# EAGLE design Qwiic_ADC_ADS1015 (EAGLE 6.5.0)
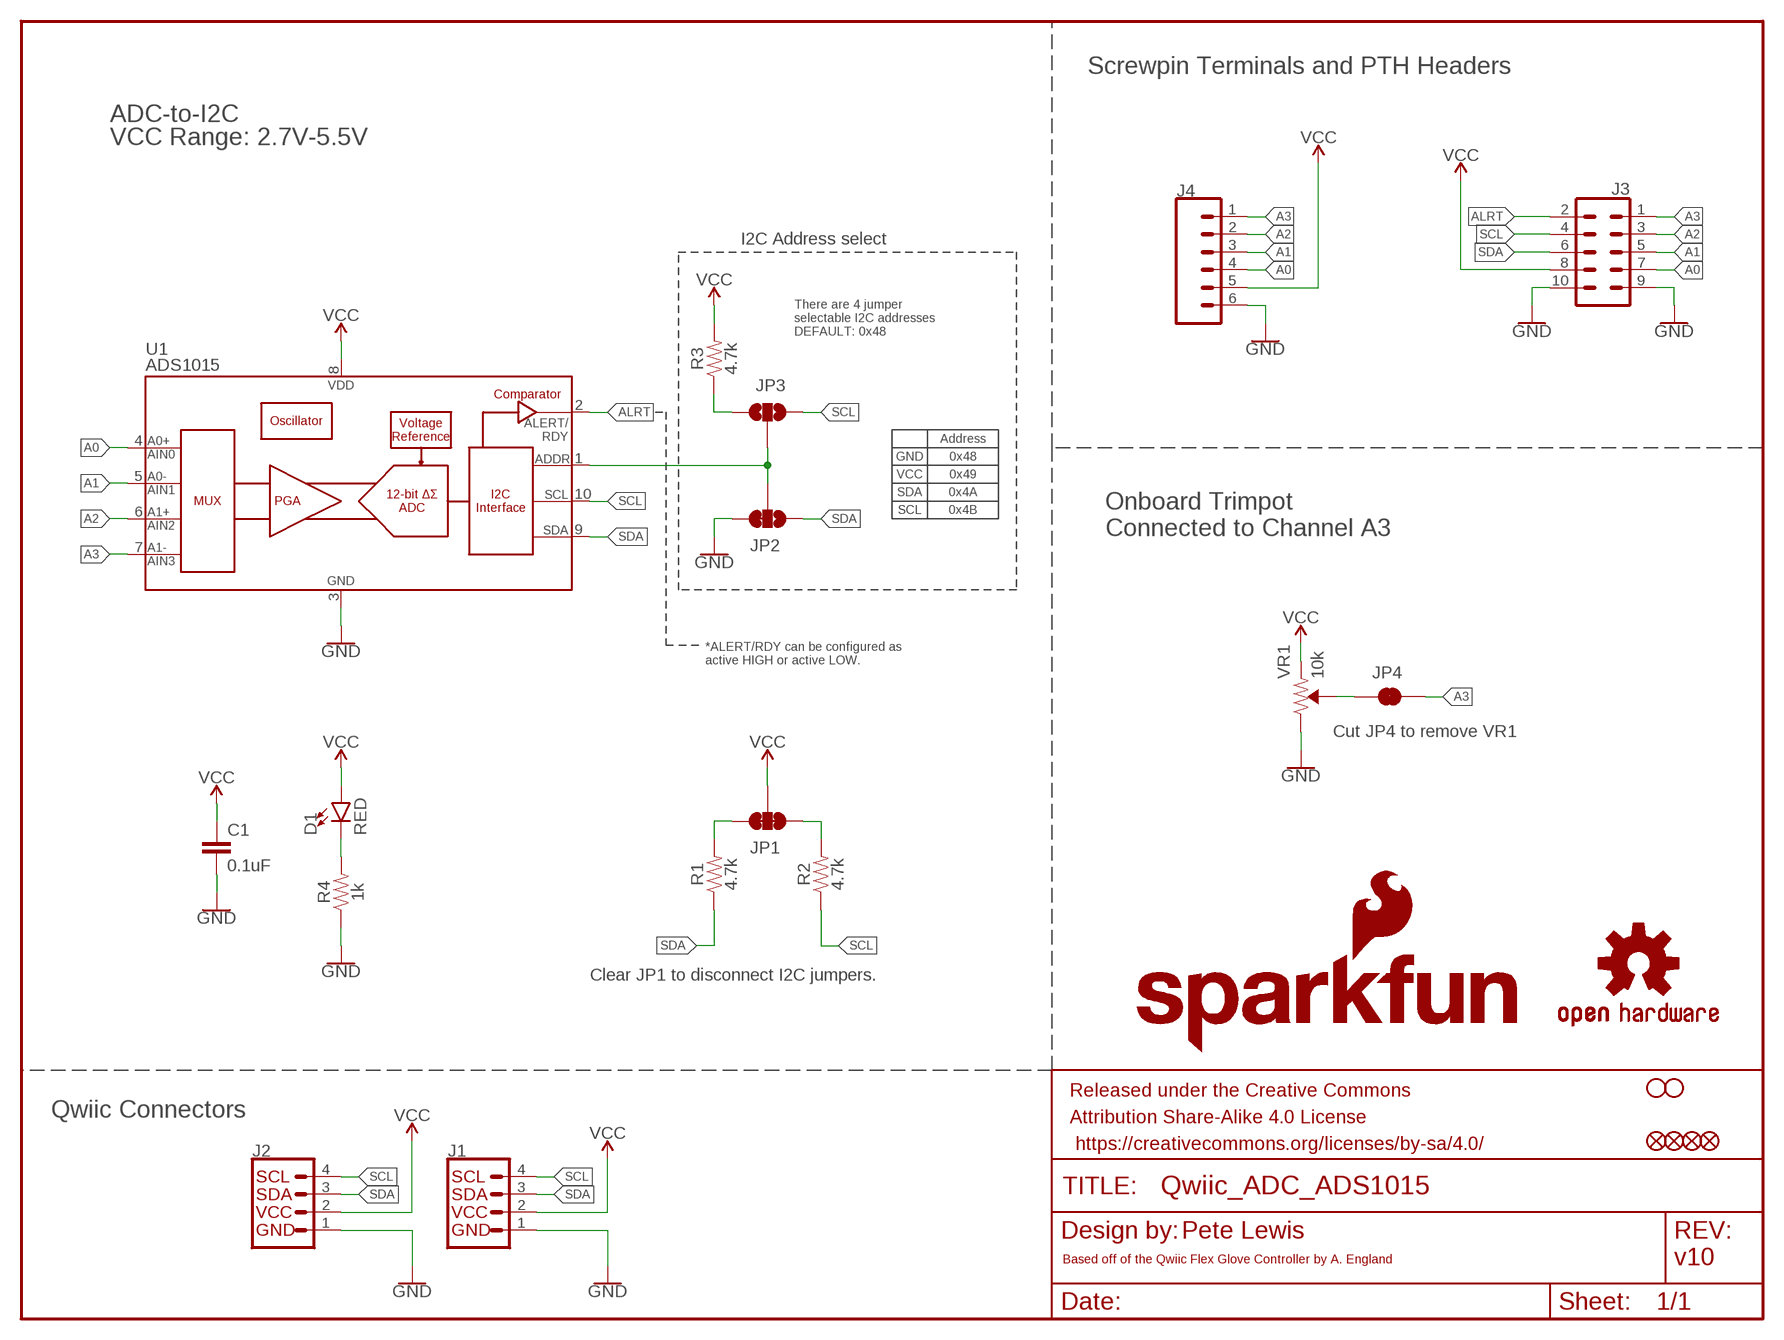
[diagram p0: schematic, sheet 1]

## Parts
C1  0.1uF  0.1UF-0603-25V-(+80/-20%)  [0603]
D1  RED  LED-RED0603  [LED-0603]
FD1  FIDUCIALUFIDUCIAL  [FIDUCIAL-MICRO]
FD2  FIDUCIALUFIDUCIAL  [FIDUCIAL-MICRO]
FD3  FIDUCIALUFIDUCIAL  [FIDUCIAL-MICRO]
FD4  FIDUCIALUFIDUCIAL  [FIDUCIAL-MICRO]
FRAME1  FRAME-LETTER  [CREATIVE_COMMONS]
H1  STAND-OFF  [STAND-OFF]
H2  STAND-OFF  [STAND-OFF]
J1  QWIIC_CONNECTORJS-1MM  [JST04_1MM_RA]
J2  QWIIC_CONNECTORJS-1MM  [JST04_1MM_RA]
J3  CONN_05X2NO_SILK  [2X5_NOSILK]
J4  Screw Pin  CONN_063.5MM-6  [SCREWTERMINAL-3.5MM-6]
JP1  JUMPER-SMT_3_2-NC_TRACE_NO-SILK  [SMT-JUMPER_3_2-NC_TRACE_NO-SILK]
JP2  JUMPER-SMT_3_1-NC_TRACE_NO-SILK  [SMT-JUMPER_3_1-NC_TRACE_NO-SILK]
JP3  JUMPER-SMT_3_NO_NO_SILK  [SMT-JUMPER_3_0-NO_TRACE_NO-SILK]
JP4  JUMPER-SMT_2_NC_TRACE_SILK  [SMT-JUMPER_2_NC_TRACE_SILK]
LOGO1  SFE_LOGO_NAME.1_INCH  [SFE_LOGO_NAME_.1]
LOGO2  OSHW-LOGOS  [OSHW-LOGO-S]
LOGO3  SFE_LOGO_FLAME.1_INCH  [SFE_LOGO_FLAME_.1]
R1  4.7k  4.7KOHM-0603-1/10W-1%  [0603]
R2  4.7k  4.7KOHM-0603-1/10W-1%  [0603]
R3  4.7k  4.7KOHM-0603-1/10W-1%  [0603]
R4  1k  1KOHM-0603-1/10W-1%  [0603]
U1  ADS1015  [MSOP10]
VR1  10k  TRIMPOT-SMD-3MM-CLOSED-1/8W-20%  [TRIMPOT-SMD-3MM-CLOSED]

## Nets
A0: J3.7 J4.4 U1.4(AIN0)
A1: J3.5 J4.3 U1.5(AIN1)
A2: J3.3 J4.2 U1.6(AIN2)
A3: J3.1 J4.1 JP4.2 U1.7(AIN3)
ADDR: JP2.2 JP3.2 U1.1(ADDR)
ALRT: J3.2 U1.2(ALERT/RDY)
GND: C1.2 J1.1 J2.1 J3.9 J3.10 J4.6 JP2.3 R4.1 U1.3(VSS) VR1.3(CW)
N$1: JP4.1 VR1.2(WIPER)
N$2: D1.C R4.2
N$3: JP3.1 R3.1
N$7: JP1.1 R2.2
N$8: JP1.3 R1.2
SCL: J1.4 J2.4 J3.4 JP3.3 R2.1 U1.10(SCL)
SDA: J1.3 J2.3 J3.6 JP2.1 R1.1 U1.9(SDA)
VCC: C1.1 D1.A J1.2 J2.2 J3.8 J4.5 JP1.2 R3.2 U1.8(VDD) VR1.1(CCW)

## Notes on the sheet
- Screwpin Terminals and PTH Headers
- ADC-to-I2C
- VCC Range: 2.7V-5.5V
- I2C Address select
- There are 4 jumper 
  selectable I2C addresses
  DEFAULT: 0x48
- Address
- GND | 0x48
- VCC | 0x49
- SDA | 0x4A
- SCL | 0x4B
- Onboard Trimpot
  Connected to Channel A3
- *ALERT/RDY can be configured as
  active HIGH or active LOW.
- Cut JP4 to remove VR1
- Clear JP1 to disconnect I2C jumpers.
- Qwiic Connectors
- Pete Lewis
- Based off of the Qwiic Flex Glove Controller by A. England | v10

## Library data of the parts
C1 = SparkFun-Capacitors:0.1UF: 0.1µF ceramic capacitors A capacitor is a passive two-terminal electrical component used to store electrical energy temporarily in an electric field.; PROD_ID: CAP-00810
D1 = SparkFun-LED:LED-RED: Red SMD LED Used in manufacturing of most products at SparkFun Packages: 0603 - SMD 0603 package [Product Link] <http://docs.avagotech.com/docs/AV02-0551EN> 0603 SMART - SMD 0603 SMART package ( more efficient and expensive)[Product Link] <http://www.osram-os.com/Graphics/XPic2/00077099_0.pdf> 1206 - SMD1206 package [Product Link] <https://www.sparkfun.com/datasheets/DevTools/LilyPad/Q150OVS4.pdff> SparkFun Products: Pro Mini 328 -5V <https://www.sparkfun.com/products/821> RedBoard <https://www.sparkfun.com/products/12757> IOIO-OTG <https://www.sparkfun.com/products/13613>; PROD_ID: DIO-00819
FD1-FD4 = SparkFun-Aesthetics:FIDUCIAL: Fiducial Alignment Points Point-of-reference for pick-and-place machines and other optical instruments.
FRAME1 = SparkFun-Aesthetics:FRAME-LETTER: Schematic Frame - Letter Standard 8.5x11 US Letter frame
H1 H2 = SparkFun-Hardware:STAND-OFF: Stand Off Drill holes for mechanically mounting via screws, standoffs, etc. Note: Use the keepout ring to avoid running the screw head into surrounding components. Variant Overviews STAND-OFF - Mechanical footprint for a #4 phillips button head screw. STAND-OFF-TIGHT - Mechanical footprint for a #4 phillips button head screw, Example SparkFun Products Screw - Phillips Head (1/4", 4-40, 10 pack) <https://www.sparkfun.com/products/10453> (PRT-10453) Screw - Phillips Head (1/2", 4-40, 10 pack) <https://www.sparkfun.com/products/10452> (PRT-10452) Screw - Phillips Head (3/4", 4-40, 10 pack) <https://www.sparkfun.com/products/10451> (PRT-10451) Screw - Phillips Head (1", 4-40, 10 pack) <https://www.sparkfun.com/products/10450> (PRT-10450)
J1 J2 = SparkFun-Connectors:QWIIC_CONNECTOR: SparkFun I2C Standard Qwiic Connector An SMD 1mm pitch JST connector makes it easy and quick (get it? Qwiic?) to connect I2C devices to each other. The Qwiic system <http://www.sparkfun.com/qwiic> enables fast and solderless connection between popular platforms and various sensors and actuators. We carry 200mm <https://www.sparkfun.com/products/14204>, 100mm <https://www.sparkfun.com/products/14205>, 50mm <https://www.sparkfun.com/products/14206>, and breadboard friendly <https://www.sparkfun.com/products/14207> Qwiic cables. We also offer 10 pcs strips <https://www.sparkfun.com/products/14323> the SMD connectors.; PROD_ID: CONN-13694
J3 = SparkFun-Connectors:CONN_05X2: Multi connection point. Often used as Generic Header-pin footprint for 0.1 inch spaced/style header connections For AVR SPI programming port, see special device with nice symbol: "AVR_SPI_PROG_5x2.dev" You can populate with any combo of single row headers, but if you'd like an exact match, check these: 2x5 AVR ICSP Male Header <https://www.sparkfun.com/products/778> (PRT-00778) 2x5 Pin Shrouded Header <https://www.sparkfun.com/products/8506> (PRT-08506) On any of the 0.1 inch spaced packages, you can populate with these: Break Away Headers - Straight <https://www.sparkfun.com/products/116> (PRT-00116) Break Away Male Headers - Right Angle <https://www.sparkfun.com/products/553> (PRT-00553) Female Headers <https://www.sparkfun.com/products/115> (PRT-00115) Break Away Headers - Machine Pin <https://www.sparkfun.com/products/117> (PRT-00117) Break Away Female Headers - Swiss Machine Pin <https://www.sparkfun.com/products/743> (PRT-00743) Special note: the shrouded connector mates well with our 5x2 ribbon cables: 2x5 Pin IDC Ribbon Cable <https://www.sparkfun.com/products/8535> (PRT-08535)
J4 = SparkFun-Connectors:CONN_06: Multi connection point. Often used as Generic Header-pin footprint for 0.1 inch spaced/style header connections On any of the 0.1 inch spaced packages, you can populate with these: Break Away Headers - Straight <https://www.sparkfun.com/products/116> (PRT-00116) Break Away Male Headers - Right Angle <https://www.sparkfun.com/products/553> (PRT-00553) Female Headers <https://www.sparkfun.com/products/115> (PRT-00115) Break Away Headers - Machine Pin <https://www.sparkfun.com/products/117> (PRT-00117) Break Away Female Headers - Swiss Machine Pin <https://www.sparkfun.com/products/743> (PRT-00743) Arduino Stackable Header - 6 Pin <https://www.sparkfun.com/products/9280> (PRT-09280) For SCREWTERMINALS and SPRING TERMINALS visit here: Screw Terimnals on SparkFun.com <https://www.sparkfun.com/search/results?term=Screw+Terminals> (5mm/3.5mm/2.54mm spacing) This device is also useful as a general connection point to wire up your design to another part of your project. Our various solder wires solder well into these plated through hole pads. Hook-Up Wire - Assortment (Stranded, 22 AWG) <https://www.sparkfun.com/products/11375> (PRT-11375) Hook-Up Wire - Assortment (Solid Core, 22 AWG) <https://www.sparkfun.com/products/11367> (PRT-11367) View the entire wire category on our website here <https://www.sparkfun.com/categories/141>; PROD_ID: CONN-13617
JP1 = SparkFun-Jumpers:JUMPER-SMT_3_2-NC_TRACE: Normally closed trace jumper (2 of 2 connections) This jumper has a trace between all three pads so they are normally closed (NC). Use a razor knife to open the connection(s). For best results follow the IPC guidelines for cutting traces: Cutout at least 0.063 mm (0.005 in). Remove all loose material to clean up the cut area. Seal the cut with an approved epoxy. Reapply solder to reclose the connection(s).
JP2 = SparkFun-Jumpers:JUMPER-SMT_3_1-NC_TRACE: Normally closed trace jumper (1 of 2 connections) This jumper has a trace between two pads so it's normally closed (NC). The other connection is normally open (NO). Use a razor knife to open the connection. For best results follow the IPC guidelines for cutting traces: Cutout at least 0.063 mm (0.005 in). Remove all loose material to clean up the cut area. Seal the cut with an approved epoxy. Reapply solder to reclose the connection, or to close the NO connection.
JP3 = SparkFun-Jumpers:JUMPER-SMT_3_NO: Normally open jumper This jumper has three pads in close proximity to each other. Apply solder to close the connection(s).
JP4 = SparkFun-Jumpers:JUMPER-SMT_2_NC_TRACE: Normally closed trace jumper This jumper has a trace between two pads so it's normally closed (NC). Use a razor knife to open the connection. For best results follow the IPC guidelines for cutting traces: Cutout at least 0.063 mm (0.005 in). Remove all loose material to clean up the cut area. Seal the cut with an approved epoxy. Reapply solder to reclose the connection.
LOGO1 = SparkFun-Aesthetics:SFE_LOGO_NAME: SparkFun Font Logo This is the SparkFun name logo. The logo on the schematic will always be the same size; the package variant is the height of the flame part of the logo (or the height the flame would be, if it were drawn). Default layer for the logo on the board is tSilk.
LOGO2 = SparkFun-Aesthetics:OSHW-LOGO: Open-Source Hardware (OSHW) Logo This logo indicates the piece of hardware it is found on incorporates a OSHW license and/or adheres to the definition of open source hardware found here: http://freedomdefined.org/OSHW
LOGO3 = SparkFun-Aesthetics:SFE_LOGO_FLAME: SparkFun Flame Logo This is the SparkFun flame logo. The logo on the schematic will always be the same size; the package variant is the height of the flame. Default layer for the logo on the board is tSilk.
R1-R3 = SparkFun-Resistors:4.7KOHM: 4.7kΩ resistor A resistor is a passive two-terminal electrical component that implements electrical resistance as a circuit element. Resistors act to reduce current flow, and, at the same time, act to lower voltage levels within circuits. - Wikipedia; PROD_ID: RES-07857
R4 = SparkFun-Resistors:1KOHM: 1kΩ resistor A resistor is a passive two-terminal electrical component that implements electrical resistance as a circuit element. Resistors act to reduce current flow, and, at the same time, act to lower voltage levels within circuits. - Wikipedia; PROD_ID: RES-07856
U1 = SparkFun-IC-Conversion:ADS1015: ADS1015 12-BIT ADC 12-Bit Del-Sig ADC Four single-ended inputs or two differential inputs Internal PGA I2C interface 2.0-5.5V SparkFun Products SparkFun Block for Intel Edison - ADC <https://www.sparkfun.com/products/13770> (DEV-13770); PROD_ID: IC-12270
VR1 = SparkFun-Resistors:TRIMPOT: Trimming Potentiometer (Trimpot) Three-terminal potentiometers, with an adjustable wiper and two adjustable resistors. A pot can be used to create a configurable voltage divider, or as a variable resistor. "Trimpots" are a subset of potentiometers, usually intended for "set-and-forget" applications. They're often more delicate than standard potentiometers - rated for fewer turns. Variants PTH-KNOB - PTH Trimpot w/ finger-adjustable knob Trimpot 10K with Knob <https://www.sparkfun.com/products/9806> (COM-09806) Datasheet <http://www.sparkfun.com/datasheets/Components/General/TSR-3386.pdf> SMD-3MM-CLOSED-FRAME - SMD 3mm Square Closed-Frame Trimpot Used on e.g. EasyDriver - Stepper Motor Driver <https://www.sparkfun.com/products/12779> Datasheet <http://www.bitechnologies.com/pdfs/22.pdf> (22AR10KTR) SMD-5MM - SMD 5mm Square Closed-Frame Trimpot Used on e.g. IOIO-OTG - V2.2 <https://www.sparkfun.com/products/13613> Datasheet <http://www.vishay.com/docs/51008/ts53.pdf> (TS53YL502MR10) SMD-3MM-1/10W-25% - 3mm Square Open-Frame Trimpot Used on e.g. SparkFun Shapeoko <https://www.sparkfun.com/products/13899> Datasheet <http://www.bourns.com/docs/Product-Datasheets/TC33.pdf> (TC33X-2-103E); PROD_ID: RES-09285

## Board
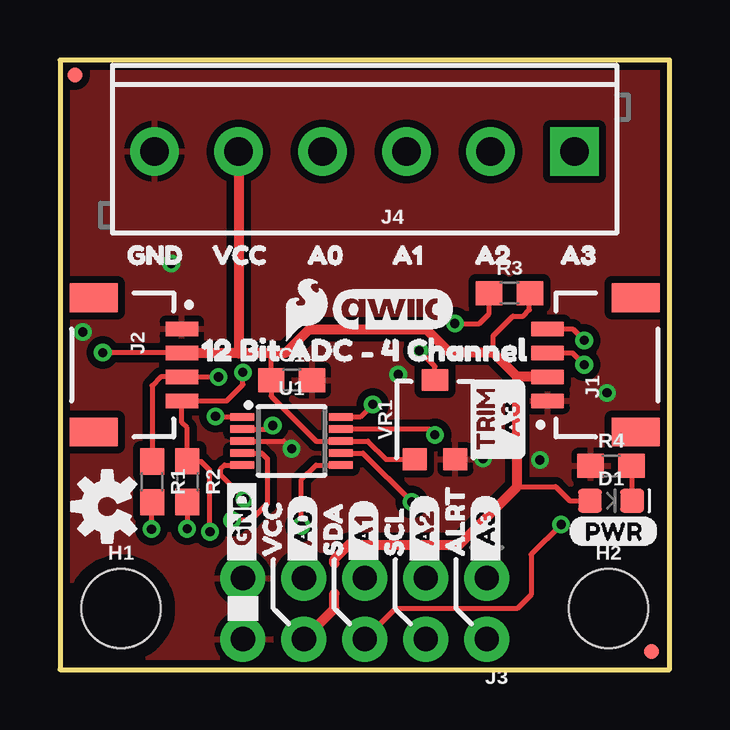
[diagram p1: board, top side]
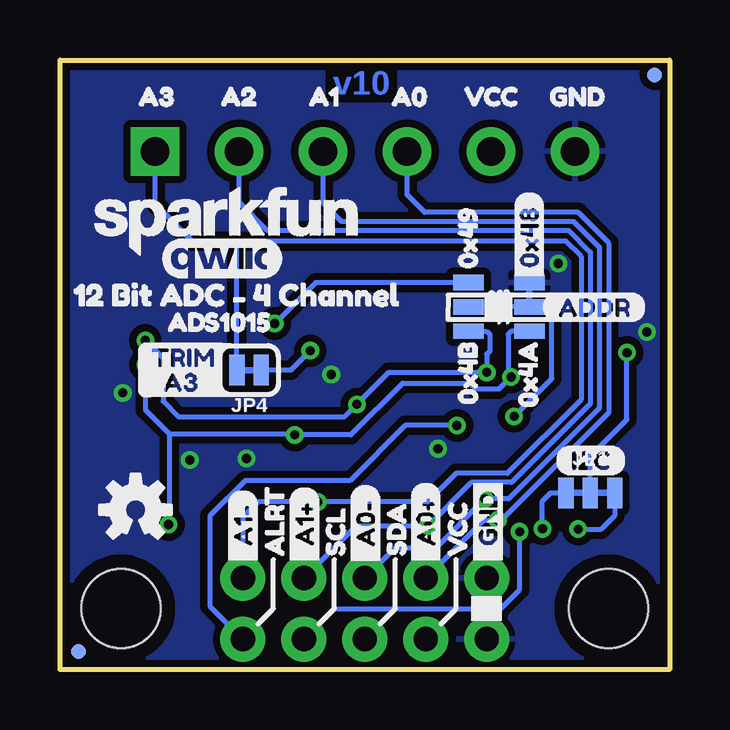
[diagram p2: board, bottom side, seen from below]

Size 25.4 x 25.4 mm. Coordinates in mm from the lower left corner, seen from the top.
Outline: 0,0 25.4,0 25.4,25.4 0,25.4 0,0
Copper layers (1*16): Top 0.035mm / dielectric 1.5mm / Bottom 0.035mm
Design rules "SparkFun-2-layer-TIGHT": minimum track width 7mil, minimum drill 15mil, track to track 7mil, track to pad 7mil, pad to pad 7mil, via to via 7mil, smd to smd 7mil, copper to edge 7mil, drill to drill 7mil, minimum pad ring 7mil, minimum via ring 7mil, stop-mask expansion 4mil, vias tented up to drill 25mil, thermal gap 10mil

### Footprints (pad centres in the part's own frame; a part is rotated, then mirrored left to right if it is on the bottom)
0603 = smd 1.1 x 1: 1 -0.85,0; 2 0.85,0
LED-0603 = smd 1 x 1: A -0.877,0; C 0.877,0
FIDUCIAL-MICRO = smd 0.635 x 0.635: 1 0,0
STAND-OFF = hole 3.302: 0,0
JST04_1MM_RA = smd 0.6 x 1.35: 1 -1.5,0; 2 -0.5,0; 3 0.5,0; 4 1.5,0 | smd 1.2 x 2: NC1 2.8,-3.675; NC2 -2.8,-3.675
2X5_NOSILK = drill 1.016 pad 1.88: 1 0,0; 2 0,2.54; 3 2.54,0; 4 2.54,2.54; 5 5.08,0; 6 5.08,2.54; 7 7.62,0; 8 7.62,2.54; 9 10.16,0; 10 10.16,2.54
SCREWTERMINAL-3.5MM-6 = drill 1.2 pad 2.032 square: 1 0,0 | drill 1.2 pad 2.032: 2 3.5,0; 3 7,0; 4 10.5,0; 5 14,0; 6 17.5,0
SMT-JUMPER_3_2-NC_TRACE_NO-SILK = smd 0.635 x 1.27: 1 -1.016,0; 2 0,0; 3 1.016,0
SMT-JUMPER_3_1-NC_TRACE_NO-SILK = smd 0.635 x 1.27: 1 -1.016,0; 2 0,0; 3 1.016,0
SMT-JUMPER_3_0-NO_TRACE_NO-SILK = smd 0.635 x 1.27: 1 -1.016,0; 2 0,0; 3 1.016,0
SMT-JUMPER_2_NC_TRACE_SILK = smd 0.635 x 1.27: 1 -0.508,0; 2 0.508,0
MSOP10 = smd 0.3 x 1: 1 -1,-2.05; 2 -0.5,-2.05; 3 0,-2.05; 4 0.5,-2.05; 5 1,-2.05; 6 1,2.05; 7 0.5,2.05; 8 0,2.05; 9 -0.5,2.05; 10 -1,2.05
TRIMPOT-SMD-3MM-CLOSED = smd 1 x 0.9: 1 -0.85,-1.65; 3 0.85,-1.65 | smd 1.1 x 0.9: 2 0,1.65

### Placement (x,y rotation side)
C1  9.65,12.06 0 top
D1  22.96,7.04 0 top
FD1  24.64,0.76 0 top
FD2  24.64,0.76 0 bottom
FD3  0.64,24.77 0 top
FD4  0.64,24.77 0 bottom
FRAME1  -11.43,-10.16 0 top  (outside the outline)
H1  2.54,2.54 0 top
H2  22.86,2.54 0 top
J1  20.32,12.7 90 top
J2  5.08,12.7 270 top
J3  17.78,3.81 180 top
J4  21.44,21.59 180 top
JP1  3.3,7.37 0 bottom
JP2  5.84,15.11 90 bottom
JP3  8.38,15.11 270 bottom
JP4  17.52,12.48 180 bottom
LOGO1  18.47,18.68 0 bottom
LOGO2  22.25,6.65 0 bottom
LOGO3  10.26,15.01 0 top
R1  3.84,7.82 270 top
R2  5.3,7.83 270 top
R3  18.73,15.68 0 top
R4  22.96,8.48 0 top
U1  9.65,9.53 270 top
U$1  [VCC1]  9.22,23.88 0 bottom
U$2  [GND0]  5.66,23.88 0 bottom
U$3  [0X4A2]  5.9,10.22 90 bottom
U$4  [0X491]  8.41,16.04 90 bottom
U$5  [A02]  12.27,23.88 0 bottom
U$6  [A13]  15.7,23.88 0 bottom
U$7  [A24]  19.38,23.88 0 bottom
U$8  [A35]  22.81,23.88 0 bottom
U$9  [_A0#3]  10.16,4.17 90 bottom
U$10  [_A0#4]  12.67,4.17 90 bottom
U$11  [TRIM7]  17.73,8.41 90 top
U$12  [0X4B3]  8.41,10.38 90 bottom
U$13  [OSHW-LOGO-S]  1.97,6.79 90 top
U$14  [_A1#5]  15.21,4.19 90 bottom
U$15  [_A1#6]  17.78,4.19 90 bottom
U$16  [12_BIT_ADC_#_4_CHANNEL1]  5.11,13.31 0 top
U$17  [_A3_0]  22.07,11.97 0 bottom
U$18  [VCC1]  8.84,4.06 90 bottom
U$19  [TRIM7]  22.31,13.01 0 bottom
U$20  [_GND17]  7.57,4.19 90 bottom
U$21  [SDA6]  11.38,4.06 90 bottom
U$22  [_A3_0]  18.77,8.73 90 top
U$23  [SCL7]  13.92,4.06 90 bottom
U$24  [ALRT8]  16.46,4.06 90 bottom
U$25  [_A013]  10.11,4.19 90 top
U$26  [_A114]  12.65,4.19 90 top
U$27  [_A215]  15.19,4.19 90 top
U$28  [_A316]  17.73,4.19 90 top
U$29  [_GND17]  7.57,4.19 90 top
U$30  [VCC1]  8.84,4.06 90 top
U$31  [SDA6]  11.38,4.06 90 top
U$32  [SCL7]  13.92,4.06 90 top
U$33  [ALRT8]  16.46,4.06 90 top
U$34  [VCC1]  5.69,17.27 0 top
U$35  [GND0]  2.13,17.27 0 top
U$36  [A02]  9.63,17.27 0 top
U$37  [A13]  13.18,17.27 0 top
U$38  [A24]  16.61,17.27 0 top
U$39  [A35]  20.17,17.27 0 top
U$40  [PWR0]  21.18,5.77 0 top
U$41  [I2C1]  4.8,8.71 0 bottom
U$42  [0X480]  5.85,16.06 90 bottom
U$43  [12_BIT_ADC_#_4_CHANNEL1]  25.64,15.61 0 bottom
U$44  [QWIIC_5MM]  13.84,15.04 0 top
U$45  [ADDR0]  5.32,15.1 0 bottom
U$46  [ADS10150]  21.59,14.48 0 bottom
U$47  [QWIIC_5MM]  18.67,17.14 0 bottom
VR1  15.62,10.41 0 top

### Tracks (layer width: path | path; a pad name or v marks a point on that pad's centre or on a via)
A0  (via drill 0.38)
  Top 0.203: 7.61,9.02 U1.4 8.4,9.03 8.64,8.79 8.64,6.91 7.95,6.22 v7.16,6.22
  Bottom 0.203: J3.7 7.75,6.22 v7.16,6.22 7.01,6.22 2.54,10.69 2.54,17.78 3.81,19.05 10.21,19.05 10.94,19.78 J4.4
A1  (via drill 0.38)
  Top 0.203: v7.7,7.11 6.71,8.1 6.71,8.38 6.85,8.53 U1.5
  Bottom 0.203: J3.5 11.46,5.05 9.75,5.05 v7.7,7.11 6.71,7.11 2.92,10.9 2.92,17.6 3.99,18.67 13.66,18.67 14.44,19.44 J4.3
A2  (via drill 0.38)
  Top 0.203: v10.06,5.99 10.06,7.92 10.66,8.53 U1.6
  Bottom 0.203: J3.3 13.06,5.99 v10.06,5.99 8.26,7.8 6.58,7.8 3.3,11.08 3.3,17.4 4.19,18.29 16.76,18.29 17.94,19.47 J4.2
A3  (via drill 0.38)
  Top 0.203: 11.71,9.02 U1.7 12.62,9.03 v14.66,6.99
  Bottom 0.203: J3.1 17.78,6.35 17.14,6.99 v14.66,6.99 10.08,6.99 8.89,8.18 6.76,8.18 3.68,11.25 3.68,17.22 4.32,17.86 18.03,17.86 | J4.1 21.44,19.41 19.88,17.86 18.03,17.86 | 18.03,17.86 18.03,17.85 JP4.2
ADDR  (via drill 0.38)
  Top 0.203: U1.1 6.5,10.53 v6.48,10.55
  Bottom 0.203: JP3.2 JP2.2 5.08,15.11 4.9,14.94 4.9,12.13 v6.48,10.55
ALRT  (via drill 0.38)
  Top 0.203: U1.2 8.72,10.03 v8.87,10.17
  Bottom 0.203: v8.87,10.17 11.01,10.17 13.31,7.87 17.68,7.87 19.15,6.4 19.15,2.64 J3.2
GND  (via drill 0.38)
  Top 0.203: U1.3 9.33,9.53 v9.65,9.2
  other vias: 14.1,12.3 4.64,16.92 17.63,8.79 19.99,8.73 22.79,11.53 0.94,14.07
  pour Bottom (isolate 0.305): 0,0 25.4,0 25.4,25.4 0,25.4
  pour Top (isolate 0.305): 25.4,0 0,0 0,25.4 25.4,25.4
N$1  (via drill 0.38)
  Top 0.203: VR1.2 15.62,12.64 v14.97,13.29
  Bottom 0.178: JP4.1 17.05,12.44
  Bottom 0.203: v14.97,13.29 15.78,12.48 JP4.1
N$2
  Top 0.203: D1.C 23.84,8.46 R4.2
N$3  (via drill 0.38)
  Top 0.203: v16.45,14.42 17.47,14.42 17.88,14.83 R3.1
  Bottom 0.203: JP3.1 14.74,16.13 v16.45,14.42
N$7  (via drill 0.38)
  Top 0.203: R2.2 v5.3,5.87
  Bottom 0.203: v5.3,5.87 5.3,7.02 4.95,7.37 JP1.1
N$8  (via drill 0.38)
  Top 0.203: R1.2 3.81,6.95 v3.81,5.86
  Bottom 0.203: JP1.3 2.29,6.41 2.85,5.86 v3.81,5.86
SCL  (via drill 0.38)
  Top 0.203: J1.4 21.36,14.2 v21.84,13.72 | v13.03,11.05 12.51,10.53 U1.10 | v6.25,5.74 6.22,5.77 6.22,8.33 5.89,8.66 5.32,8.66 R2.1 5.3,10.07 5.08,10.29 J2.4 6.95,11.2 7.62,11.87 v7.62,12.38
  Bottom 0.203: v21.84,13.72 21.11,12.98 21.11,11.18 20.47,10.54 13.54,10.54 v13.03,11.05 11.7,12.38 v7.62,12.38 7.62,13.14 7.49,13.27 7.49,13.97 7.62,14.1 JP3.3 | J3.4 13.97,2.54 7.04,2.54 6.25,3.33 v6.25,5.74
SDA  (via drill 0.38)
  Top 0.203: J1.3 21.34,13.2 v21.84,12.7 | v15.62,9.78 15.38,10.03 U1.9 | v6.6,12.19 v6.6,12.2 J2.3 4.19,12.19 3.83,11.84 R1.1 | v20.88,6.04 19.63,4.8 19.63,3.12 19.05,2.54 13.97,2.54 J3.6
  Bottom 0.203: 20.85,9.83 15.67,9.83 v15.62,9.78 13.28,9.78 11.12,11.94 8.32,11.94 8.06,11.68 7.11,11.68 v6.6,12.19 6.73,12.32 6.73,13.97 6.6,14.1 JP2.1 | v21.84,12.7 21.84,10.82 20.85,9.83 | 20.85,9.83 20.85,6.07 v20.88,6.04
VCC  (via drill 0.38)
  Top 0.203: C1.1 8.68,12.19 | C1.1 8.8,11.39 10.67,9.53 U1.8 12.83,9.53 13.59,8.76 VR1.1 | J2.2 v1.79,13.2 v1.78,13.21 | 19.05,7.62 20.65,7.62 21.23,7.04 D1.A | 11.43,3.17 11.43,4.42 | 18.05,13.2 18.05,13.91 18.87,14.73 19.3,14.73 19.56,14.99 19.56,15.66 R3.2 | C1.1 8.8,13.19 8.82,13.21
  Top 0.406: J1.2 19.05,12.2 | 19.05,12.2 19.05,7.62 16.64,5.21 12.04,5.21 11.43,4.6 11.43,4.42 | J2.2 7.44,13.2 | J3.8 11.43,2.54 11.43,3.17 | 19.05,12.2 18.05,13.2 16.24,13.2 15.26,14.18 10.38,14.18 9.41,13.21 8.82,13.21 7.44,13.21 | J4.5 7.44,13.21 | 7.44,13.21 7.44,13.2 | 7.44,13.2 7.46,13.18
  Bottom 0.203: JP1.2 3.3,8.89 1.78,10.41 v1.78,13.21

### Text on the board
Bottom: v10
tDocu: Pete Lewis | Based off the Qwiic Flex Controller by A. England